# EAGLE design addonv2 (EAGLE 6.6.0)
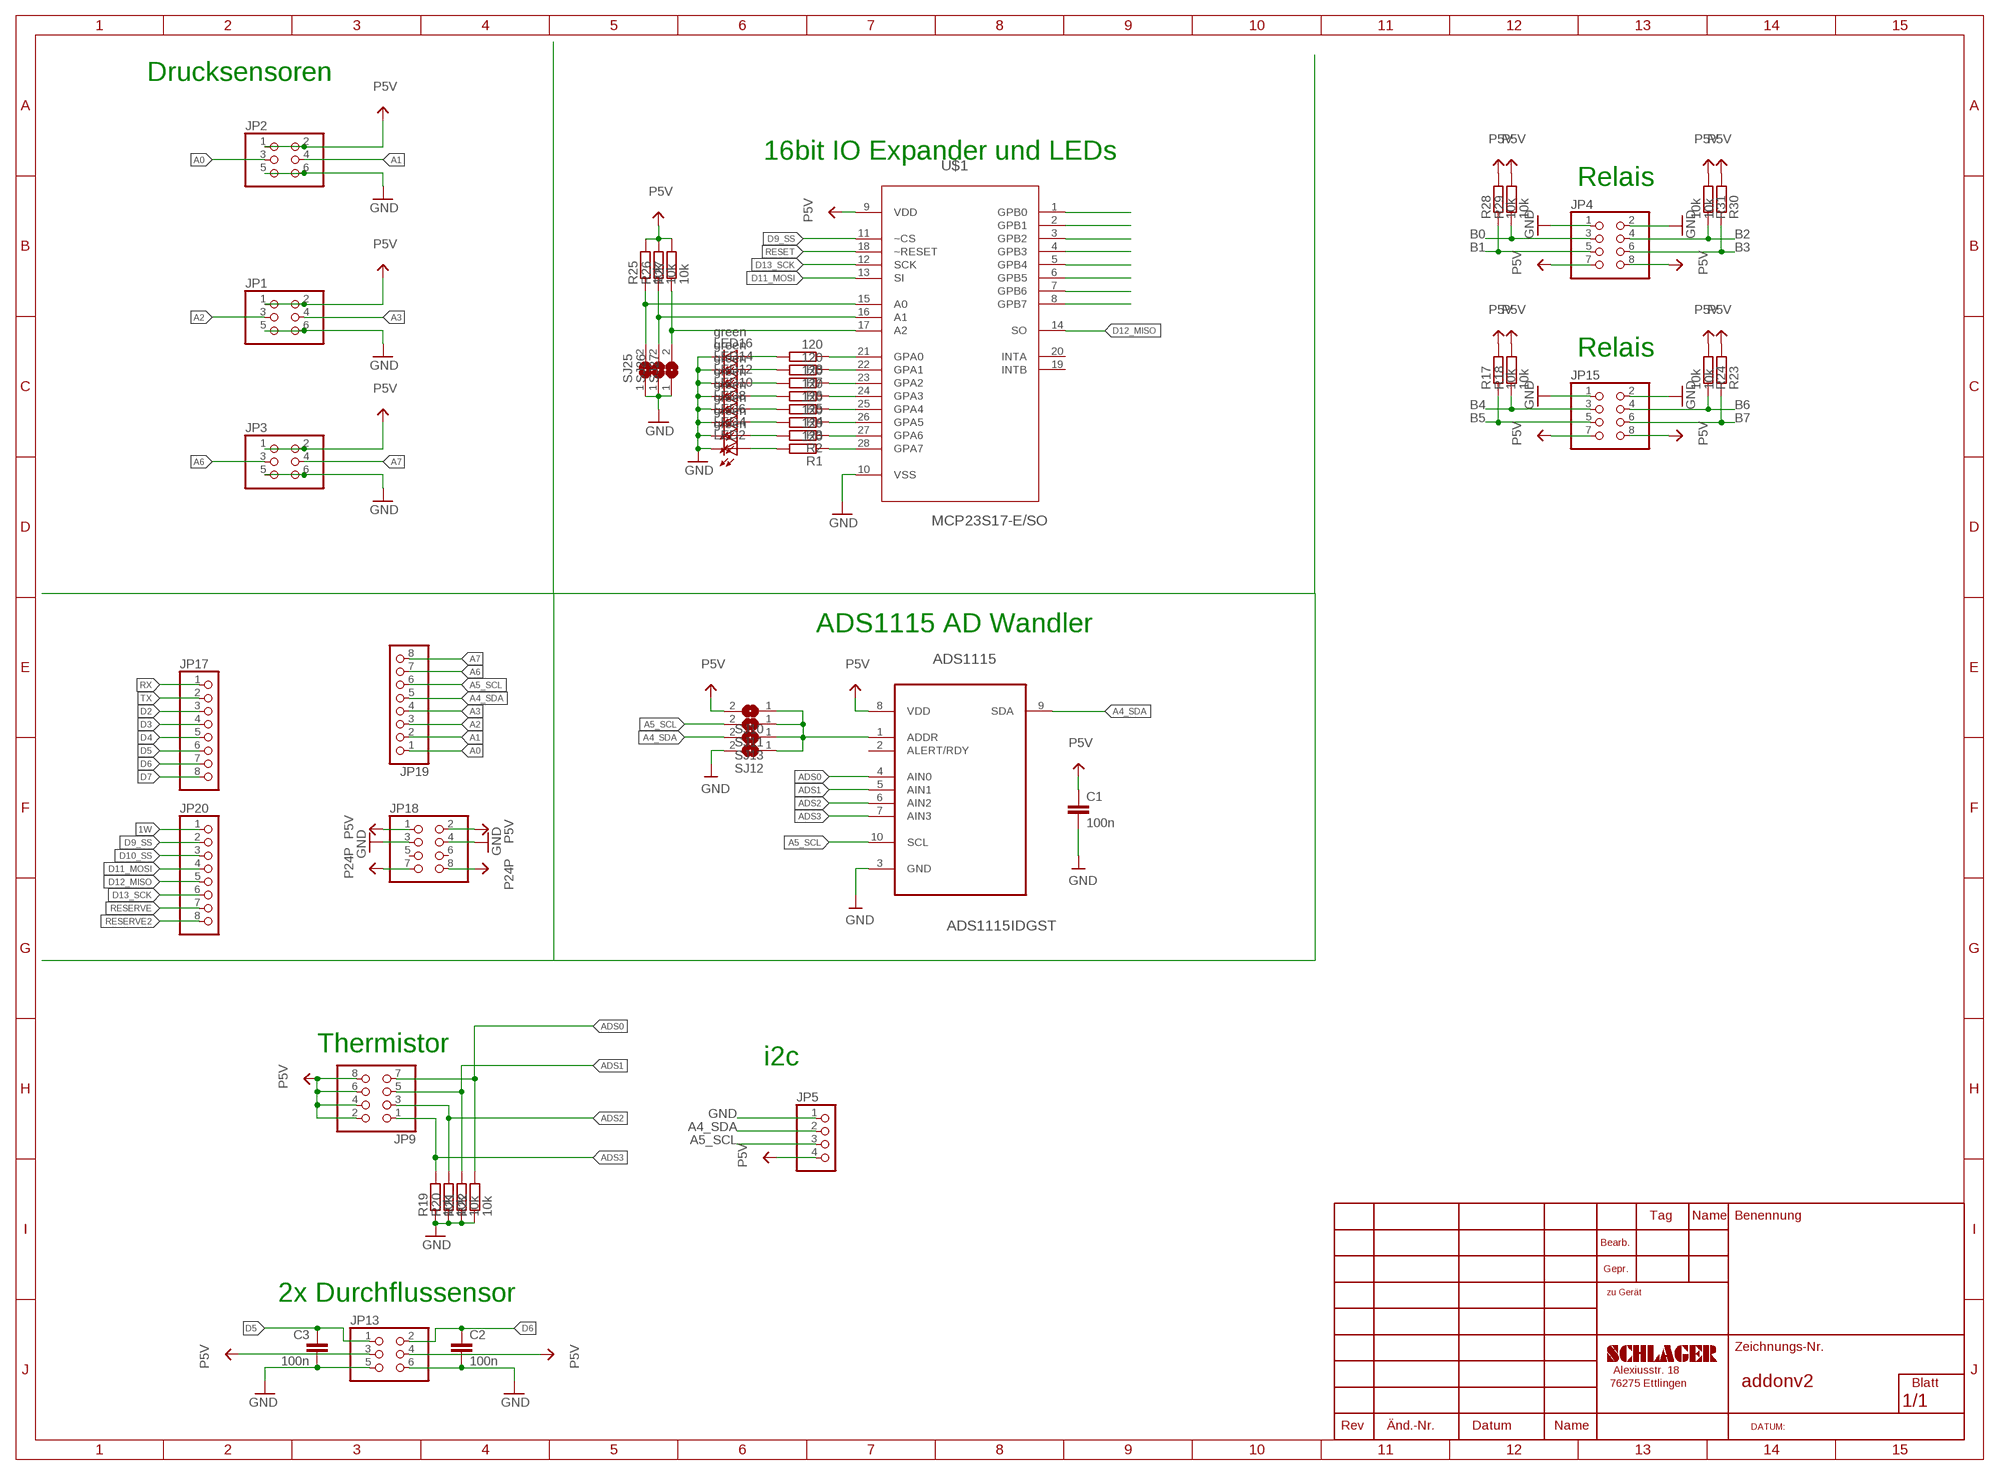
[diagram p0: schematic, sheet 1]

## Parts
ADS1115  ADS1115IDGST  [SOP50P490X110-10N]
C1  100n  C-EUC0805  [C0805]
C2  100n  C-EUC0805  [C0805]
C3  100n  C-EUC0805  [C0805]
JP1  PINHD-2X3/90  [2X03/90]
JP2  PINHD-2X3/90  [2X03/90]
JP3  PINHD-2X3/90  [2X03/90]
JP4  PINHD-2X4/90  [2X04/90]
JP5  PINHD-1X4/90  [1X04/90]
JP9  PINHD-2X4/90  [2X04/90]
JP13  PINHD-2X3/90  [2X03/90]
JP15  PINHD-2X4/90  [2X04/90]
JP17  PINHD-1X8  [1X08]
JP18  PINHD-2X4  [2X04]
JP19  PINHD-1X8  [1X08]
JP20  PINHD-1X8  [1X08]
LED2  green  LEDCHIPLED_0805  [CHIPLED_0805]
LED4  green  LEDCHIPLED_0805  [CHIPLED_0805]
LED6  green  LEDCHIPLED_0805  [CHIPLED_0805]
LED8  green  LEDCHIPLED_0805  [CHIPLED_0805]
LED10  green  LEDCHIPLED_0805  [CHIPLED_0805]
LED12  green  LEDCHIPLED_0805  [CHIPLED_0805]
LED14  green  LEDCHIPLED_0805  [CHIPLED_0805]
LED16  green  LEDCHIPLED_0805  [CHIPLED_0805]
R1  120  R-EU_R0603  [R0603]
R2  120  R-EU_R0603  [R0603]
R3  120  R-EU_R0603  [R0603]
R4  120  R-EU_R0603  [R0603]
R5  120  R-EU_R0603  [R0603]
R6  120  R-EU_R0603  [R0603]
R7  120  R-EU_R0603  [R0603]
R8  120  R-EU_R0603  [R0603]
R17  10k  R-EU_R0603  [R0603]
R18  10k  R-EU_R0603  [R0603]
R19  10k  R-EU_R0603  [R0603]
R20  10k  R-EU_R0603  [R0603]
R21  10k  R-EU_R0603  [R0603]
R22  10k  R-EU_R0603  [R0603]
R23  10k  R-EU_R0603  [R0603]
R24  10k  R-EU_R0603  [R0603]
R25  10k  R-EU_R0603  [R0603]
R26  10k  R-EU_R0603  [R0603]
R27  10k  R-EU_R0603  [R0603]
R28  10k  R-EU_R0603  [R0603]
R29  10k  R-EU_R0603  [R0603]
R30  10k  R-EU_R0603  [R0603]
R31  10k  R-EU_R0603  [R0603]
SJ10  SJN  [SJ]
SJ11  SJN  [SJ]
SJ12  SJN  [SJ]
SJ13  SJN  [SJ]
SJ25  SJN  [SJ]
SJ26  SJN  [SJ]
SJ27  SJN  [SJ]
U$1  MCP23S17-E/SO  [SOIC127P030X265-28N]

## Nets
1W: JP20.1
A0: JP2.3 JP19.1
A1: JP2.4 JP19.2
A2: JP1.3 JP19.3
A3: JP1.4 JP19.4
A4_SDA: ADS1115.9(SDA) JP5.2 JP19.5 SJ13.2
A5_SCL: ADS1115.10(SCL) JP5.3 JP19.6 SJ11.2
A6: JP3.3 JP19.7
A7: JP3.4 JP19.8
ADS0: ADS1115.4(AIN0) JP9.7 R22.2
ADS1: ADS1115.5(AIN1) JP9.5 R21.2
ADS2: ADS1115.6(AIN2) JP9.3 R20.2
ADS3: ADS1115.7(AIN3) JP9.1 R19.2
B0: JP4.3 R29.1 U$1.1(GPB0)
B1: JP4.5 R28.1 U$1.2(GPB1)
B2: JP4.4 R31.1 U$1.3(GPB2)
B3: JP4.6 R30.1 U$1.4(GPB3)
B4: JP15.3 R18.1 U$1.5(GPB4)
B5: JP15.5 R17.1 U$1.6(GPB5)
B6: JP15.4 R24.1 U$1.7(GPB6)
B7: JP15.6 R23.1 U$1.8(GPB7)
D2: JP17.3
D3: JP17.4
D4: JP17.5
D5: C3.1 JP13.1 JP17.6
D6: C2.1 JP13.2 JP17.7
D7: JP17.8
D9_SS: JP20.2 U$1.11(~CS)
D10_SS: JP20.3
D11_MOSI: JP20.4 U$1.13(SI)
D12_MISO: JP20.5 U$1.14(SO)
D13_SCK: JP20.6 U$1.12(SCK)
GND: ADS1115.3(GND) C1.2 C2.2 C3.2 JP1.5 JP1.6 JP2.5 JP2.6 JP3.5 JP3.6 JP4.1 JP4.2 JP5.1 JP13.5 JP13.6 JP15.1 JP15.2 JP18.3 JP18.4 LED2.C LED4.C LED6.C LED8.C LED10.C LED12.C LED14.C LED16.C R19.1 R20.1 R21.1 R22.1 SJ12.2 SJ25.1 SJ26.1 SJ27.1 U$1.10(VSS)
N$17: LED2.A R1.2
N$18: LED4.A R2.2
N$19: LED6.A R3.2
N$20: LED8.A R4.2
N$21: LED10.A R5.2
N$22: LED12.A R6.2
N$23: LED14.A R7.2
N$24: LED16.A R8.2
N$25: R1.1 U$1.28(GPA7)
N$26: R2.1 U$1.27(GPA6)
N$27: R3.1 U$1.26(GPA5)
N$28: R4.1 U$1.25(GPA4)
N$29: R5.1 U$1.24(GPA3)
N$30: R6.1 U$1.23(GPA2)
N$31: R7.1 U$1.22(GPA1)
N$32: R8.1 U$1.21(GPA0)
N$36: ADS1115.1(ADDR) SJ10.1 SJ11.1 SJ12.1 SJ13.1
N$38: R25.1 SJ25.2 U$1.15(A0)
N$39: R26.1 SJ26.2 U$1.16(A1)
N$40: R27.1 SJ27.2 U$1.17(A2)
P5V: ADS1115.8(VDD) C1.1 JP1.1 JP1.2 JP2.1 JP2.2 JP3.1 JP3.2 JP4.7 JP4.8 JP5.4 JP9.2 JP9.4 JP9.6 JP9.8 JP13.3 JP13.4 JP15.7 JP15.8 JP18.1 JP18.2 R17.2 R18.2 R23.2 R24.2 R25.2 R26.2 R27.2 R28.2 R29.2 R30.2 R31.2 SJ10.2 U$1.9(VDD)
P24P: JP18.7 JP18.8
RESERVE: JP20.7
RESERVE2: JP20.8
RESET: U$1.18(~RESET)
RX: JP17.1
TX: JP17.2
Unconnected: ADS1115.2(ALERT/RDY) JP18.5 JP18.6 U$1.19(INTB) U$1.20(INTA)

## Notes on the sheet
- Drucksensoren
- 16bit IO Expander und LEDs
- Relais
- Relais
- ADS1115 AD Wandler
- Thermistor
- i2c
- 2x Durchflussensor

## Library data of the parts
ADS1115 = schlager_ics:ADS1115IDGST: Analog-to-Digital Converter with Internal Reference; MPN: ADS1115IDGST; OC_FARNELL: 1762981; OC_NEWARK: 25R1241; PACKAGE: MSOP-10; SUPPLIER: Texas Instruments
C1-C3 = schlager_passiv:C-EU: CAPACITOR, European symbol
JP1-JP3 JP13 = pinhead:PINHD-2X3: PIN HEADER
JP4 JP9 JP15 JP18 = pinhead:PINHD-2X4: PIN HEADER
JP5 = pinhead:PINHD-1X4: PIN HEADER
JP17 JP19 JP20 = pinhead:PINHD-1X8: PIN HEADER
LED2 LED4 LED6 LED8 LED10 LED12 LED14 LED16 = led:LED: LED OSRAM: - CHIPLED LG R971, LG N971, LY N971, LG Q971, LY Q971, LO R971, LY R971 LH N974, LH R974 LS Q976, LO Q976, LY Q976 LO Q996 - Hyper CHIPLED LW Q18S LB Q993, LB Q99A, LB R99A - SideLED LS A670, LO A670, LY A670, LG A670, LP A670 LB A673, LV A673, LT A673, LW A673 LH A674 LY A675 LS A676, LA A676, LO A676, LY A676, LW A676 LS A679, LY A679, LG A679 - Hyper Micro SIDELED® LS Y876, LA Y876, LO Y876, LY Y876 LT Y87S - SmartLED LW L88C, LW L88S LB L89C, LB L89S, LG L890 LS L89K, LO L89K, LY L89K LS L896, LA L896, LO L896, LY L896 - TOPLED LS T670, LO T670, LY T670, LG T670, LP T670 LSG T670, LSP T670, LSY T670, LOP T670, LYG T670 LG T671, LOG T671, LSG T671 LB T673, LV T673, LT T673, LW T673 LH T674 LS T676, LA T676, LO T676, LY T676, LB T676, LH T676, LSB T676, LW T676 LB T67C, LV T67C, LT T67C, LS T67K, LO T67K, LY T67K, LW E67C LS E67B, LA E67B, LO E67B, LY E67B, LB E67C, LV E67C, LT E67C LW T67C LS T679, LY T679, LG T679 LS T770, LO T770, LY T770, LG T770, LP T770 LB T773, LV T773, LT T773, LW T773 LH T774 LS E675, LA E675, LY E675, LS T675 LS T776, LA T776, LO T776, LY T776, LB T776 LHGB T686 LT T68C, LB T68C - Hyper Mini TOPLED® LB M676 - Mini TOPLED Santana® LG M470 LS M47K, LO M47K, LY M47K Source: http://www.osram.convergy.de LUXEON: - LUMILED® LXK2-PW12-R00, LXK2-PW12-S00, LXK2-PW14-U00, LXK2-PW14-V00 LXK2-PM12-R00, LXK2-PM12-S00, LXK2-PM14-U00 LXK2-PE12-Q00, LXK2-PE12-R00, LXK2-PE12-S00, LXK2-PE14-T00, LXK2-PE14-U00 LXK2-PB12-K00, LXK2-PB12-L00, LXK2-PB12-M00, LXK2-PB14-N00, LXK2-PB14-P00, LXK2-PB14-Q00 LXK2-PR12-L00, LXK2-PR12-M00, LXK2-PR14-Q00, LXK2-PR14-R00 LXK2-PD12-Q00, LXK2-PD12-R00, LXK2-PD12-S00 LXK2-PH12-R00, LXK2-PH12-S00 LXK2-PL12-P00, LXK2-PL12-Q00, LXK2-PL12-R00 Source: www.luxeon.com KINGBRIGHT: KA-3528ASYC Source: www.kingbright.com
R1-R8 R17-R31 = debauer_passiv:R-EU_: RESISTOR, European symbol
SJ10-SJ13 SJ25-SJ27 = jumper:SJ: SMD solder JUMPER
U$1 = schlager_ics:MCP23S17-E/SO: 16-Bit I/O Expander; DESCRIPTION: IC I/O EXPANDER; MPN: MCP23S17-E/SO; OC_FARNELL: 1332093; OC_NEWARK: 31K2950; PACKAGE: SOIC-28; SUPPLIER: Microchip

## Net classes
4 USBpair: width 0.254 mm, drill 0.406 mm, clearance 0.508 mm

## Board
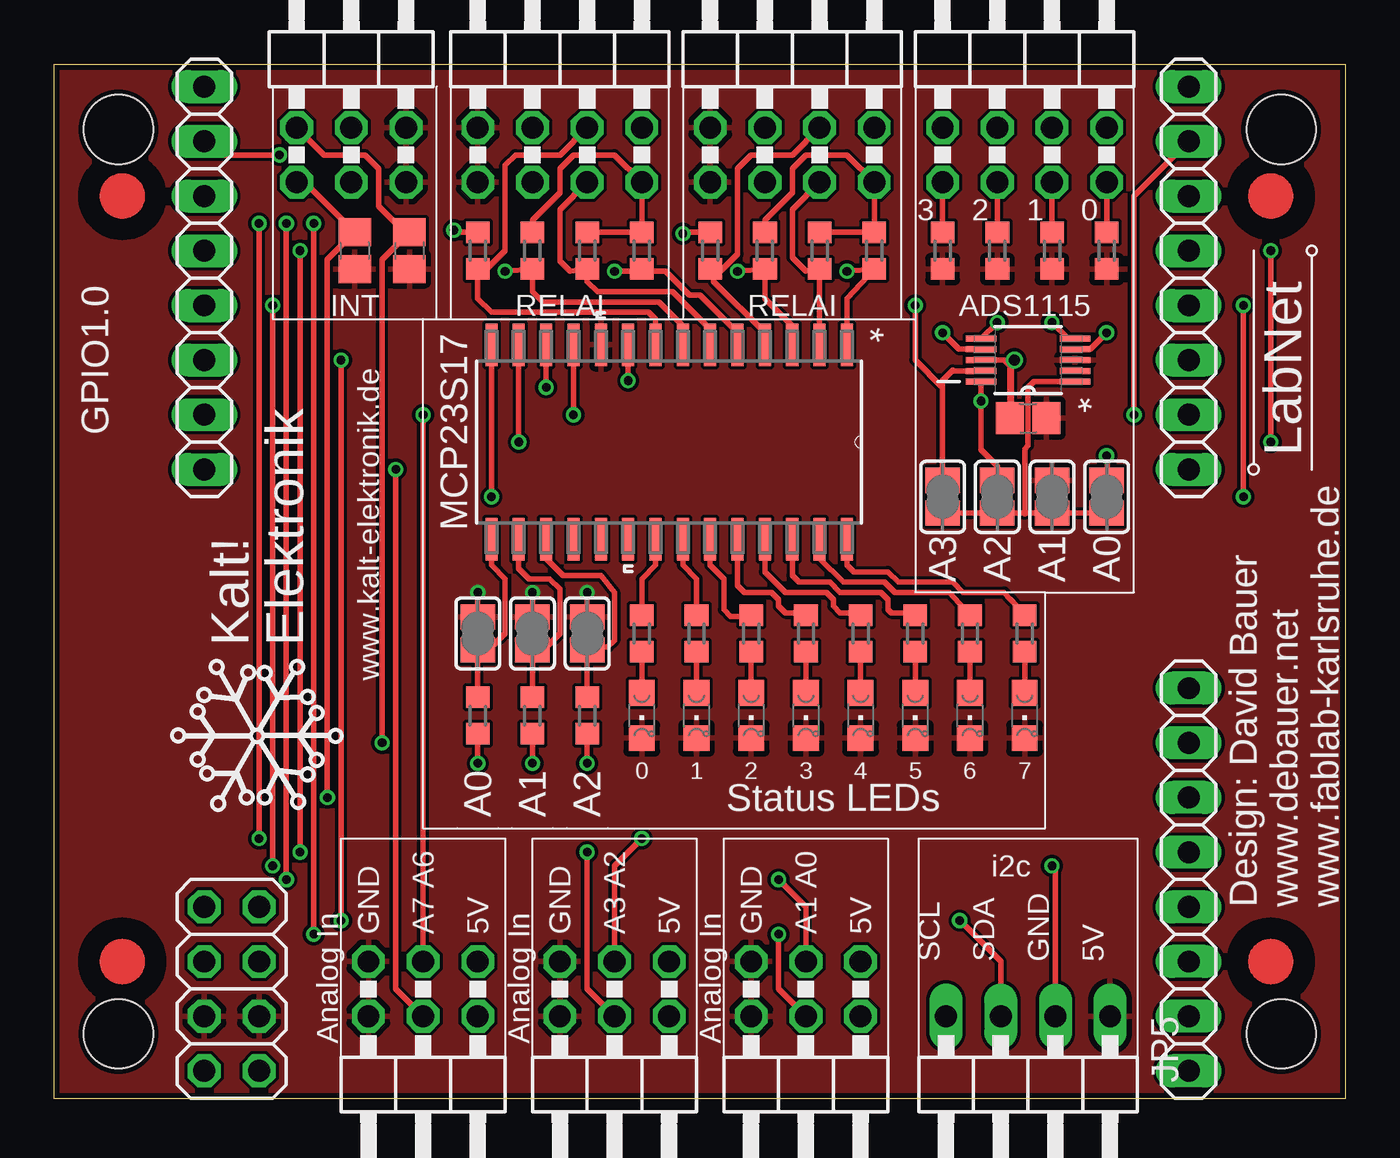
[diagram p1: board, top side]
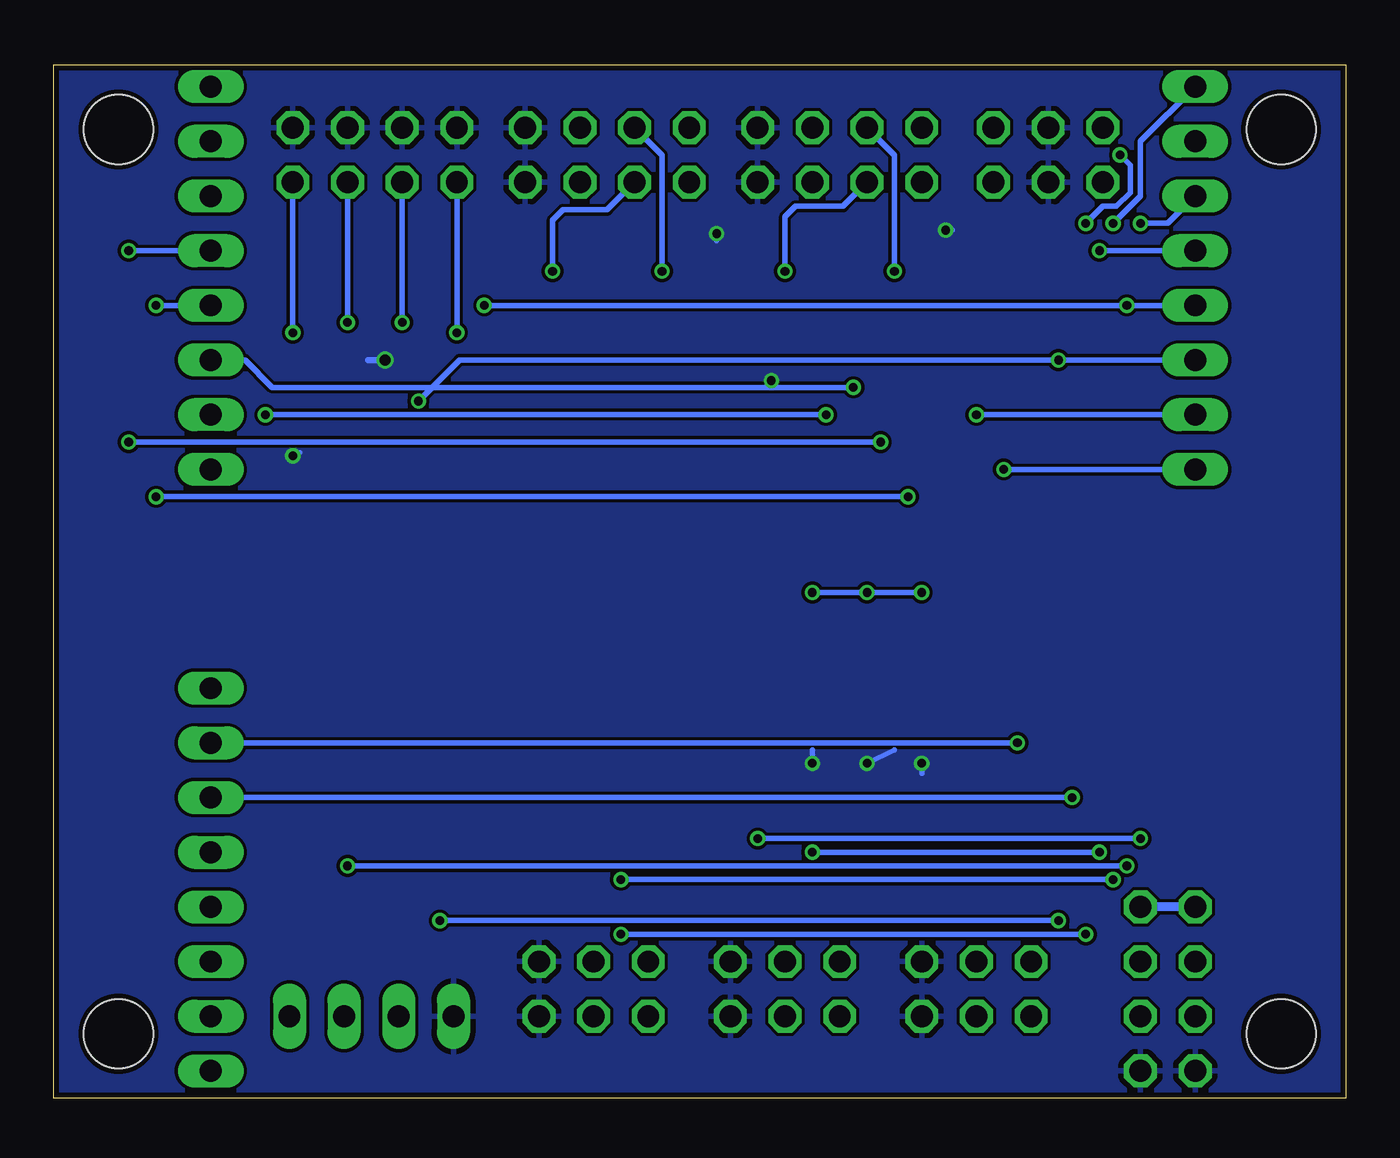
[diagram p2: board, bottom side, seen from below]

Size 60 x 48 mm. Coordinates in mm from the lower left corner, seen from the top.
Outline: 0,0 60,0 60,48 0,48 0,0
Copper layers (1*16): Top 0.035mm / dielectric 1.5mm / Bottom 0.035mm
Design rules "ITEADstudio_DRC": minimum track width 6mil, minimum drill 12mil, track to track 6mil, track to pad 6mil, pad to pad 6mil, via to via 6mil, smd to smd 0mil, copper to edge 10mil, drill to drill 10mil, minimum pad ring 10mil, minimum via ring 6mil, stop-mask expansion 2mil, vias tented up to drill 100mil, thermal gap 10mil
Holes 3.2 mm at 57,45 57,3 3,45 3,3

### Footprints (pad centres in the part's own frame; a part is rotated, then mirrored left to right if it is on the bottom)
SOP50P490X110-10N = smd 1.422 x 0.279: 1 -2.184,0.991; 2 -2.184,0.508; 3 -2.184,0; 4 -2.184,-0.508; 5 -2.184,-0.991; 6 2.184,-0.991; 7 2.184,-0.508; 8 2.184,0; 9 2.184,0.508; 10 2.184,0.991
C0805 = smd 1.3 x 1.5: 1 -0.85,0; 2 0.85,0
2X03/90 = drill 1.016 octagon: 1 -2.54,-6.35; 2 -2.54,-3.81; 3 0,-6.35; 4 0,-3.81; 5 2.54,-6.35; 6 2.54,-3.81
2X04/90 = drill 1.016 octagon: 1 -3.81,-6.35; 2 -3.81,-3.81; 3 -1.27,-6.35; 4 -1.27,-3.81; 5 1.27,-6.35; 6 1.27,-3.81; 7 3.81,-6.35; 8 3.81,-3.81
1X04/90 = drill 1.016 long: 1 -3.81,-3.81; 2 -1.27,-3.81; 3 1.27,-3.81; 4 3.81,-3.81
1X08 = drill 1.016 long: 1 -8.89,0; 2 -6.35,0; 3 -3.81,0; 4 -1.27,0; 5 1.27,0; 6 3.81,0; 7 6.35,0; 8 8.89,0
2X04 = drill 1.016 octagon: 1 -3.81,-1.27; 2 -3.81,1.27; 3 -1.27,-1.27; 4 -1.27,1.27; 5 1.27,-1.27; 6 1.27,1.27; 7 3.81,-1.27; 8 3.81,1.27
CHIPLED_0805 = smd 1.2 x 1.2: A 0,-1.05; C 0,1.05
R0603 = smd 1 x 1.1: 1 -0.85,0; 2 0.85,0
SJ = smd 1.168 x 1.6: 1 -0.762,0; 2 0.762,0
SOIC127P030X265-28N = smd 1.981 x 0.559: 1 -4.521,8.255; 2 -4.521,6.985; 3 -4.521,5.715; 4 -4.521,4.445; 5 -4.521,3.175; 6 -4.521,1.905; 7 -4.521,0.635; 8 -4.521,-0.635; 9 -4.521,-1.905; 10 -4.521,-3.175; 11 -4.521,-4.445; 12 -4.521,-5.715; 13 -4.521,-6.985; 14 -4.521,-8.255; 15 4.521,-8.255; 16 4.521,-6.985; 17 4.521,-5.715; 18 4.521,-4.445; 19 4.521,-3.175; 20 4.521,-1.905; 21 4.521,-0.635; 22 4.521,0.635; 23 4.521,1.905; 24 4.521,3.175; 25 4.521,4.445; 26 4.521,5.715; 27 4.521,6.985; 28 4.521,8.255

### Placement (x,y rotation side)
ADS1115  45.25,34.29 180 top
C1  45.25,31.59 0 top
C2  16.52,39.37 270 top
C3  13.98,39.37 270 top
JP1  26.04,0 180 top
JP2  34.93,0 180 top
JP3  17.15,0 180 top
JP4  34.3,48.9 0 top
JP5  45.25,0 180 top
JP9  45.09,48.9 0 top
JP13  13.82,48.9 0 top
JP15  23.5,48.9 0 top
JP17  52.71,10.16 90 top
JP18  8.26,5.08 90 top
JP19  6.99,38.1 270 top
JP20  52.71,38.1 270 top
LED2  45.09,17.78 180 top
LED4  42.55,17.78 180 top
LED6  40.01,17.78 180 top
LED8  37.47,17.78 180 top
LED10  34.93,17.78 180 top
LED12  32.39,17.78 180 top
LED14  29.85,17.78 180 top
LED16  27.31,17.78 180 top
R1  45.09,21.59 270 top
R2  42.55,21.59 270 top
R3  40.01,21.59 270 top
R4  37.47,21.59 270 top
R5  34.93,21.59 270 top
R6  32.39,21.59 270 top
R7  29.85,21.59 270 top
R8  27.31,21.59 270 top
R17  24.77,39.37 90 top
R18  27.31,39.37 90 top
R19  41.28,39.37 90 top
R20  43.82,39.37 90 top
R21  46.36,39.37 90 top
R22  48.9,39.37 90 top
R23  19.69,39.37 90 top
R24  22.23,39.37 90 top
R25  19.69,17.78 270 top
R26  22.23,17.78 270 top
R27  24.77,17.78 270 top
R28  35.56,39.37 90 top
R29  38.11,39.37 90 top
R30  30.48,39.37 90 top
R31  33.03,39.37 90 top
SJ10  48.9,27.94 90 top
SJ11  43.82,27.94 90 top
SJ12  46.36,27.94 90 top
SJ13  41.28,27.94 90 top
SJ25  19.69,21.59 270 top
SJ26  22.23,21.59 270 top
SJ27  24.77,21.59 270 top
U$1  28.58,30.48 270 top
U$2  [KALT!ELEKTRONIK]  9.53,24.13 90 top
U$3  [PASSMARK]  3.18,6.35 0 top
U$4  [PASSMARK]  56.52,6.35 0 top
U$5  [PASSMARK]  56.52,41.91 0 top
U$7  [PASSMARK]  3.18,41.91 0 top
U$8  [LABNET]  57.79,34.29 90 top

### Tracks (layer width: path | path; a pad name or v marks a point on that pad's centre or on a via)
A0  (via drill 0.4)
  Top 0.254: v10.8,10.16 v10.8,40.64 | JP2.3 34.93,8.89 v33.66,10.16
  Bottom 0.254: v33.66,10.16 v10.8,10.16 | v10.8,40.64 9.53,41.91 9.53,44.45 JP19.1
A1  (via drill 0.4)
  Top 0.254: JP2.4 33.66,5.08 v33.66,7.62 | v12.07,7.62 v12.07,40.64 | v10.48,43.81 7.62,43.81 JP19.2
  Bottom 0.254: v33.66,7.62 v12.07,7.62 | v12.07,40.64 11.28,41.43 10.64,41.43 10.01,42.07 10.01,43.34 v10.48,43.81
A2  (via drill 0.4)
  Top 0.254: v9.53,12.06 v9.53,40.64 | JP1.3 26.04,10.79 v27.31,12.06
  Bottom 0.254: v27.31,12.06 v9.53,12.06 | 5.72,41.91 JP19.3 8.26,40.64 v9.53,40.64
A3  (via drill 0.4)
  Top 0.254: JP1.4 24.77,5.08 v24.77,11.43 | v11.44,11.43 v11.44,39.37
  Bottom 0.254: v24.77,11.43 v11.44,11.43 | v11.44,39.37 JP19.4
A4_SDA  (via drill 0.4)
  Top 0.254: SJ13.2 41.28,33.02 | 41.28,33.02 41.28,33.34 41.76,33.81 41.79,33.78 ADS1115.9 | v40.01,36.83 40.01,34.29 41.28,33.02 | v10.16,10.79 v10.16,36.83 | JP5.2 46.52,10.64 v46.36,10.79
  Bottom 0.254: JP19.5 v10.16,36.83 v40.01,36.83 | v46.36,10.79 v10.16,10.79
A5_SCL  (via drill 0.4)
  Top 0.254: SJ11.2 43.82,29.37 43.06,30.12 v43.06,32.38 ADS1115.10 | v13.34,8.26 v13.34,34.29 | JP5.3 43.98,6.35 v42.07,8.26
  Bottom 0.254: JP19.6 v13.34,34.29 41.16,34.29 v43.06,32.38 | v42.07,8.26 v13.34,8.26
A6  (via drill 0.4)
  Top 0.254: JP3.3 v17.15,31.75
  Bottom 0.254: v17.15,31.75 JP19.7
A7  (via drill 0.4)
  Top 0.254: JP3.4 15.88,5.08 v15.88,29.21
  Bottom 0.254: v15.88,29.21 JP19.8
ADS0  (via drill 0.4)
  Top 0.254: ADS1115.4 48.14,34.8 v48.9,35.56 | R22.2 JP9.7
  Bottom 0.254: v48.9,35.56 JP9.7
ADS1  (via drill 0.4)
  Top 0.254: ADS1115.5 47.12,35.28 v46.36,36.04 | R21.2 JP9.5
  Bottom 0.254: v46.36,36.04 JP9.5
ADS2  (via drill 0.4)
  Top 0.254: ADS1115.6 v43.82,36.04 | R20.2 JP9.3
  Bottom 0.254: v43.82,36.04 JP9.3
ADS3  (via drill 0.4)
  Top 0.254: ADS1115.7 42.04,34.8 v41.28,35.56 | R19.2 JP9.1
  Bottom 0.254: v41.28,35.56 JP9.1
B0  (via drill 0.4)
  Top 0.254: U$1.1 36.83,37.15 R29.1 v36.84,38.42 v36.83,38.42
  Bottom 0.254: v36.83,38.42 36.83,40.8 36.36,41.27 34.3,41.27 JP4.3
B1
  Top 0.254: U$1.2 R28.1 34.93,38.42 34.3,39.05 34.3,41.27 JP4.5
B2  (via drill 0.4)
  Top 0.254: U$1.3 34.3,35.88 33.03,37.15 R31.1 v31.76,38.42 v31.75,38.42
  Bottom 0.254: v31.75,38.42 31.75,43.81 JP4.4
B3
  Top 0.254: U$1.4 33.03,35.56 30.64,37.94 30.64,38.26 R30.1 30.96,38.42 31.75,39.21 31.75,43.18 32.39,43.81 34.3,43.81 JP4.6
B4  (via drill 0.4)
  Top 0.254: U$1.5 31.75,35.56 30.01,37.31 29.53,37.31 28.42,38.42 27.31,38.42 | 27.31,38.42 R18.1 | 27.31,38.42 v26.04,38.42
  Bottom 0.254: v26.04,38.42 26.04,40.96 25.56,41.43 23.34,41.43 JP15.3
B5
  Top 0.254: U$1.6 30.48,35.72 28.74,37.47 25.25,37.47 24.77,37.94 R17.1 23.97,38.42 23.5,38.89 23.5,41.27 JP15.5
B6  (via drill 0.4)
  Top 0.254: U$1.7 29.22,35.88 28.1,36.99 22.71,36.99 22.23,37.47 R24.1 v20.96,38.42
  Bottom 0.254: v20.96,38.42 20.96,43.81 JP15.4
B7
  Top 0.254: U$1.8 27.94,36.2 27.63,36.51 20.33,36.51 19.69,37.15 R23.1 20.01,38.42 20.96,39.37 20.96,43.34 21.44,43.81 23.5,43.81 JP15.6
D5  (via drill 0.4)
  Top 0.254: JP13.1 11.65,42.55 C3.1 12.7,38.95 v12.7,13.97
  Bottom 0.254: JP17.6 v12.7,13.97
D6  (via drill 0.4)
  Top 0.254: v15.24,16.51 15.24,38.95 C2.1 16.3,40.22 15.09,41.43 15.09,43.18 14.45,43.81 12.55,43.81 JP13.2
  Bottom 0.254: JP17.7 v15.24,16.51
D9_SS  (via drill 0.4)
  Top 0.254: U$1.11 v24.14,31.75 | v50.17,31.75 50.17,41.91 JP20.2
  Bottom 0.254: v24.14,31.75 v50.17,31.75
D11_MOSI  (via drill 0.4)
  Top 0.254: U$1.13 v21.59,30.48 | v56.52,30.48 v56.52,39.37
  Bottom 0.254: v21.59,30.48 v56.52,30.48 | v56.52,39.37 JP20.4
D12_MISO  (via drill 0.4)
  Top 0.254: U$1.14 v20.33,27.94 | v55.25,27.94 v55.25,36.83
  Bottom 0.254: v20.33,27.94 v55.25,27.94 | v55.25,36.83 JP20.5
D13_SCK  (via drill 0.4)
  Top 0.254: U$1.12 v22.87,33.02
  Bottom 0.254: v22.87,33.02 49.85,33.02 51.12,34.29 JP20.6
GND  (via drill 0.4)
  Top 0.254: SJ26.1 v22.23,23.5 | v19.69,23.5 SJ25.1 | SJ27.1 v24.77,23.5
  Bottom 0.254: v19.69,23.5 v22.23,23.5 v24.77,23.5
  pour Top (rank 5): -86.2,68.58 67.95,68.58 67.95,-30.48 -86.51,-30.32
N$17
  Top 0.254: R1.2 LED2.A
N$18
  Top 0.254: LED4.A R2.2
N$19
  Top 0.254: R3.2 LED6.A
N$20
  Top 0.254: LED8.A R4.2
N$21
  Top 0.254: R5.2 LED10.A
N$22
  Top 0.254: LED12.A R6.2
N$23
  Top 0.254: R7.2 LED14.A
N$24
  Top 0.254: LED16.A R8.2
N$25
  Top 0.254: 44.45,23.18 R1.1 44.14,23.5 42.23,23.5 41.76,23.97 39.22,23.97 38.74,24.45 37.15,24.45 36.83,24.77 U$1.28
N$26
  Top 0.254: U$1.27 35.56,25.08 36.68,23.97 38.58,23.97 39.06,23.5 41.59,23.5 R2.1
N$27
  Top 0.254: U$1.26 34.3,24.29 34.61,23.97 36.04,23.97 36.52,23.5 38.42,23.5 38.74,23.18 38.74,22.7 38.9,22.54 40.01,22.54 R3.1
N$28
  Top 0.254: U$1.25 33.03,24.45 33.98,23.5 35.88,23.5 36.2,23.18 36.2,22.86 36.52,22.54 37.47,22.54 R4.1
N$29
  Top 0.254: U$1.24 31.75,23.81 32.07,23.5 33.34,23.5 33.66,23.18 33.66,22.86 33.98,22.54 34.93,22.54 R5.1
N$30
  Top 0.254: U$1.23 30.48,24.77 31.12,24.13 31.12,22.7 31.44,22.38 32.23,22.38 R6.1
N$31
  Top 0.254: U$1.22 29.22,24.77 29.85,24.13 R7.1
N$32
  Top 0.254: U$1.21 27.94,24.77 27.31,24.13 R8.1
N$36
  Top 0.254: SJ13.1 SJ12.1 | SJ11.1 SJ12.1 | SJ12.1 SJ10.1 | SJ12.1 45.12,27.18 45.09,27.15 45.09,30.16 45.25,30.32 45.25,33.02 45.53,33.3 ADS1115.1
N$38
  Top 0.254: R25.1 19.69,20.32 | 19.69,20.32 SJ25.2 | U$1.15 20.33,24.77 20.96,24.13 20.96,21.59 19.69,20.32
N$39
  Top 0.254: R26.1 SJ26.2 22.74,20.83 23.5,21.59 23.5,23.65 23.02,24.13 22.07,24.13 21.59,24.61 U$1.16
N$40
  Top 0.254: R27.1 SJ27.2 24.9,20.95 25.72,20.95 26.04,21.27 26.04,23.5 25.41,24.29 23.66,24.29 22.87,25.08 U$1.17
P5V  (via drill 0.4, 0.5)
  Top 0.254: U$1.9 v26.67,33.34 | ADS1115.8 44.14,34.29 44.4,34.03 C1.1 | R26.2 v22.23,15.56 | R25.2 v19.69,15.56 | R27.2 v24.77,15.56 | SJ10.2 48.93,29.5 v48.9,29.84 | R23.2 18.68,40.22 v18.58,40.32 | R17.2 R18.2 JP15.7 26.04,43.81 24.14,43.81 23.5,43.18 23.5,42.07 22.23,40.8 R24.2 | R30.2 29.27,40.22 v29.22,40.16 | R31.2 33.03,40.8 34.3,42.07 34.3,43.18 34.93,43.81 36.83,43.81 JP4.7 R29.2 R28.2
  Top 0.305: C1.1 44.45,31.59 44.45,34.13 v44.61,34.29
  Bottom 0.254: v22.23,15.56 20.96,16.19 | v19.69,15.56 19.69,15.08 | v24.77,15.56 24.77,16.19 | v48.9,29.84 48.58,30 | v18.58,40.32 18.26,40.32 | v29.22,40.16 29.22,39.85
  Bottom 0.305: v44.61,34.29 45.41,34.29
  pour Bottom: -89.53,71.12 79.38,71.12 79.38,-38.1 -88.26,-39.37
P24P
  Bottom 0.406: JP18.8 JP18.7

### Text on the board
tPlace: 3 | 2 | 1 | 0 | INT | RELAI | RELAI | ADS1115 | GPIO1.0 | MCP23S17 | www.kalt-elektronik.de | A3 | A2 | A1 | A0 | A0 | A1 | A2 | 0 | 1 | 2 | 3 | 4 | 5 | 6 | 7 | Status LEDs | i2c | Design: David Bauer | www.debauer.net | www.fablab-karlsruhe.de | GND | A7 A6 | 5V | GND | A3 A2 | 5V | GND | A1 A0 | 5V | SCL | SDA | GND | 5V | Analog In | Analog In | Analog In